# Altium project LAN test monitor.PrjPcb
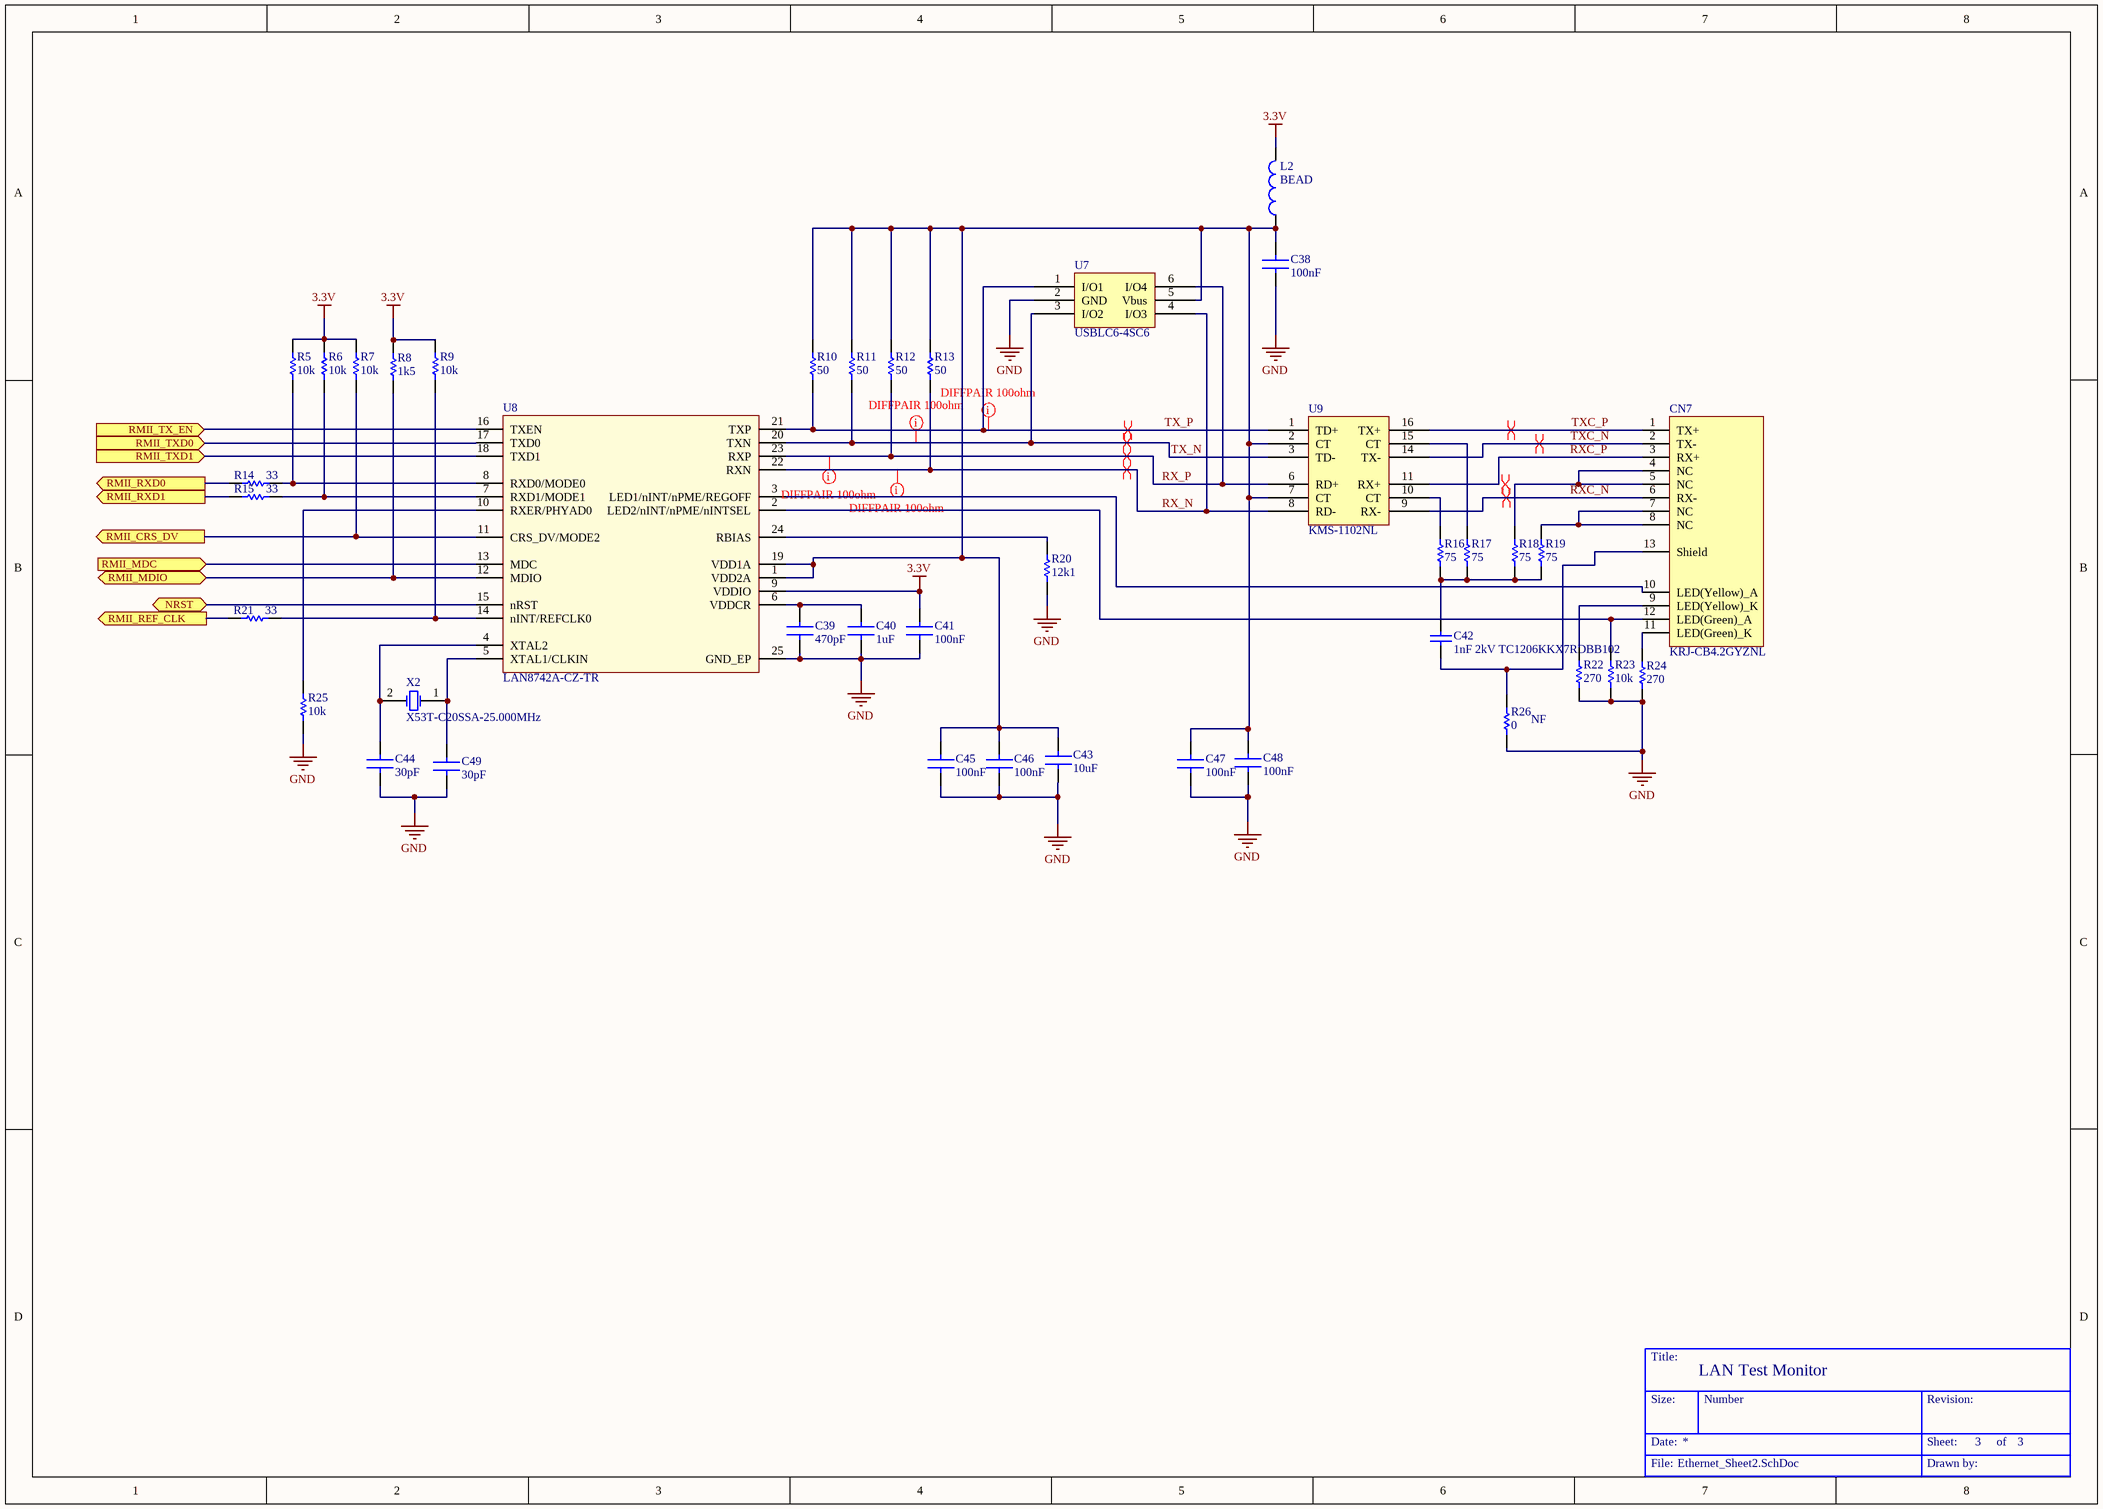
[diagram p0: Ethernet_Sheet2.SchDoc]
3 sheets, 218 parts. Net scope: flat (ports and power ports of the same name join across sheets).
Board file: Test_Monitor_PCB1.PcbDoc
Sheets:
  Ethernet_Sheet2.SchDoc
  MCU_Sheet1.SchDoc
  Input_Stage.SchDoc

## Sheet Ethernet_Sheet2.SchDoc
size A3; SheetNumber: 3; SheetTotal: 3

### Parts
(Parts that share a designator on the sheet are numbered #1, #2 ... from top to bottom, then left to right.)
*#1  Title Block  (value not drawn)  (graphical)
C38  100nF  [Cap_0603]
C39  470pF  [Cap_0603]
C40  1uF  [Cap_0603]
C41  100nF  [Cap_0603]
C42  1nF 2kV TC1206KKX7RDBB102  [CAP_1206]
C43  10uF  [Cap_0603]
C44  30pF  [Cap_0603]
C45  100nF  [Cap_0603]
C46  100nF  [Cap_0603]
C47  100nF  [Cap_0603]
C48  100nF  [Cap_0603]
C49  30pF  [Cap_0603]
CN7  KRJ-CB4.2GYZNL  [RJ45_KRJ-CB4.2GYZNL]
L2  BEAD  [Cap_0603]
R5  10k  [Res_0603]
R6  10k  [Res_0603]
R7  10k  [Res_0603]
R8  1k5  [Res_0603]
R9  10k  [Res_0603]
R10  50  [Res_0603]
R11  50  [Res_0603]
R12  50  [Res_0603]
R13  50  [Res_0603]
R14  33  [Res_0603]
R15  33  [Res_0603]
R16  75  [Res_0603]
R17  75  [Res_0603]
R18  75  [Res_0603]
R19  75  [Res_0603]
R20  12k1  [Res_0603]
R21  33  [Res_0603]
R22  270  [Res_0603]
R23  10k  [Res_0603]
R24  270  [Res_0603]
R25  10k  [Res_0603]
R26  0  [Res_0603]
U7  USBLC6-4SC6  [SOT23-6L]
U8  LAN8742A-CZ-TR  [QFN24_0R5_4X4]
U9  KMS-1102NL  [Trans. KMS-1102NL]
X2  X53T-C20SSA-25.000MHz  [XTAL_2SM_5R0X3R2]

### Ports
NRST (bidir), RMII_CRS_DV (out), RMII_MDC (in), RMII_MDIO (bidir), RMII_REF_CLK (out), RMII_RXD0 (out), RMII_RXD1 (out), RMII_TX_EN (in), RMII_TXD0 (in), RMII_TXD1 (in)

### Nets
3.3V: C41.2 L2.2 R5.2 R6.2 R7.2 R8.1 R9.2 U8.9(VDDIO)
GND: C38.1 C39.1 C40.1 C41.1 C43.1 C44.1 C45.1 C46.1 C47.1 C48.1 C49.1 R20.1 R22.1 R23.1 R24.1 R25.2 R26.1 U7.2(GND) U8.25(GND_EP)
RX_N: R13.1 U7.4(I/O3) U8.22(RXN) U9.8(RD-)
RX_P: R12.1 U7.6(I/O4) U8.23(RXP) U9.6(RD+)
RXC_N: CN7.6(RX-) U9.9(RX-)
RXC_P: CN7.3(RX+) U9.11(RX+)
TX_N: R11.1 U7.3(I/O2) U8.20(TXN) U9.3(TD-)
TX_P: R10.1 U7.1(I/O1) U8.21(TXP) U9.1(TD+)
TXC_N: CN7.2(TX-) U9.14(TX-)
TXC_P: CN7.1(TX+) U9.16(TX+)
NetC38_2: C38.2 C43.2 C45.2 C46.2 C47.2 C48.2 L2.1 R10.2 R11.2 R12.2 R13.2 U7.5(Vbus) U8.1(VDD2A) U8.19(VDD1A) U9.2(CT) U9.7(CT)
NetC39_2: C39.2 C40.2 U8.6(VDDCR)
NetC42_1: C42.1 CN7.13(Shield) R26.2
NetC42_2: C42.2 R16.1 R17.1 R18.1 R19.1
NetC44_2: C44.2 U8.4(XTAL2) X2.2(OSC2)
NetC49_2: C49.2 U8.5(XTAL1/CLKIN) X2.1(OSC1)
NetCN6_7: U8.15(nRST) ; port NRST
NetCN7_4: CN7.4(NC) CN7.5(NC) R18.2
NetCN7_7: CN7.7(NC) CN7.8(NC) R19.2
NetCN7_9: CN7.9(LED(Yellow)_K) R22.2
NetCN7_10: CN7.10(LED(Yellow)_A) U8.3(LED1/nINT/nPME/REGOFF)
NetCN7_11: CN7.11(LED(Green)_K) R24.2
NetCN7_12: CN7.12(LED(Green)_A) R23.2 U8.2(LED2/nINT/nPME/nINTSEL)
NetR5_1: R5.1 R14.2 U8.8(RXD0/MODE0)
NetR6_1: R6.1 R15.2 U8.7(RXD1/MODE1)
NetR7_1: R7.1 U8.11(CRS_DV/MODE2) ; port RMII_CRS_DV
NetR8_2: R8.2 U8.12(MDIO) ; port RMII_MDIO
NetR9_1: R9.1 R21.2 U8.14(nINT/REFCLK0)
NetR14_1: R14.1 ; port RMII_RXD0
NetR15_1: R15.1 ; port RMII_RXD1
NetR16_2: R16.2 U9.10(CT)
NetR17_2: R17.2 U9.15(CT)
NetR20_2: R20.2 U8.24(RBIAS)
NetR21_1: R21.1 ; port RMII_REF_CLK
NetR25_1: R25.1 U8.10(RXER/PHYAD0)
NetU1_27: U8.13(MDC) ; port RMII_MDC
NetU1_74: U8.18(TXD1) ; port RMII_TXD1
NetU1_126: U8.16(TXEN) ; port RMII_TX_EN
NetU1_128: U8.17(TXD0) ; port RMII_TXD0

### Layout directives
differential pair; rule Matched Net Lengths [Tolerance = 1mm]: RX_N, RX_P, RXC_N, RXC_P, TX_N, TX_P, TXC_N, TXC_P
mark named DIFFPAIR 100ohm: RX_N, RX_P, TX_N, TX_P

### Notes on the sheet
- (near R26) NF
- (in symbol Title Block) Title:; LAN Test Monitor; Size:; Number; Revision:; Date:; Sheet:; of; File:; Drawn by:

### Library data of the parts
C38 C41 C45-C48 = Cap 100nF 0603 10%
C39 = Cap 470pF 0603 10%
C40 = Cap 1uF 0603 10%
C42 = Cap 1nF 2kV: Capacitor 1nF 2kV; Value: 100nF; Revision: July-2002: Re-released for DXP Platform.
C43 = Cap 10uF 0603 10%
C44 C49 = Cap 30 pF 0603
CN7 = KRJ-CB4.2GYZNL: 100 Base-TX (Fast Ethernet) SMD RJ45 single port (1x1) with LEDS Integrated Magnetics Connector; Manuf_1: HanRun; Manuf_Part_1: HR961160C; Manuf_2: Pulse Electronics Corporation; Manuf_Part_2: J3011G21DNLT; Manuf_3: K.O.D International Holding; Manuf_Part_3: RMT-119A-12F6-GY-04; Distrib: Sub Co; Order: *
L2 = Inductor: Value: 100uH; Published: 8-Jun-2000; Revision: July-2002: Re-released for DXP Platform.; Publisher: Altium Limited
R5-R7 R9 R23 R25 = Res 10k 1% 0603: Manuf_Part_1: MCT 0603-50 1% P5 12K1; Manuf_1: VISHAY; Value: 12K1; Order: 2325243; ECCN_US/EU: n/a; Distrib: FARNELL
R8 = Res 1k5 1% 0603: Manuf_Part_1: MCT 0603-50 1% P5 12K1; Manuf_1: VISHAY; Value: 12K1; Order: 2325243; ECCN_US/EU: n/a; Distrib: FARNELL
R10-R13 = Res 50 1% 0603: Manuf_Part_1: MCT 0603-50 1% P5 12K1; Manuf_1: VISHAY; Value: 12K1; Order: 2325243; ECCN_US/EU: n/a; Distrib: FARNELL
R14 R15 R21 = Res 33 1% 0603: Manuf_Part_1: MCT 0603-50 1% P5 12K1; Manuf_1: VISHAY; Value: 12K1; Order: 2325243; ECCN_US/EU: n/a; Distrib: FARNELL
R16-R19 = Res 75 1% 0603: Manuf_Part_1: MCT 0603-50 1% P5 12K1; Manuf_1: VISHAY; Value: 12K1; Order: 2325243; ECCN_US/EU: n/a; Distrib: FARNELL
R20 = Res 12k1 1% 0603: Manuf_Part_1: MCT 0603-50 1% P5 12K1; Manuf_1: VISHAY; Order: 2325243; Value: 12K1; ECCN_US/EU: n/a; Distrib: FARNELL
R22 R24 = Res 270 1% 0603: Manuf_Part_1: MCT 0603-50 1% P5 12K1; Manuf_1: VISHAY; Value: 12K1; Order: 2325243; ECCN_US/EU: n/a; Distrib: FARNELL
R26 = Res 0 1% 0603: Manuf_Part_1: MCT 0603-50 1% P5 12K1; Manuf_1: VISHAY; Value: 12K1; Order: 2325243; ECCN_US/EU: n/a; Distrib: FARNELL
U8 = LAN8742A-CZ-TR: LAN8742A-CZ-TR - Small Footprint RMII 10/100 Ethernet, Transceiver with HP Auto-MDIX and flexPWR Technology SQFN-24; Manuf_1: MICROCHIP; Order: LAN8742A-CZ-TR; Manuf_Part_1: LAN8742A-CZ-TR; Distrib: MICROCHIP
U9 = KMS-1102NL_1
X2 = X53T-C20SSA-25.000MHz: Crystal Oscillator 25M; Published: 8-Jun-2000; LatestRevisionDate: 17-Jul-2002; LatestRevisionNote: Re-released for DXP Platform.; PackageReference: R38; Publisher: Altium Limited

## Sheet MCU_Sheet1.SchDoc
size A3; SheetNumber: 1; SheetTotal: 3
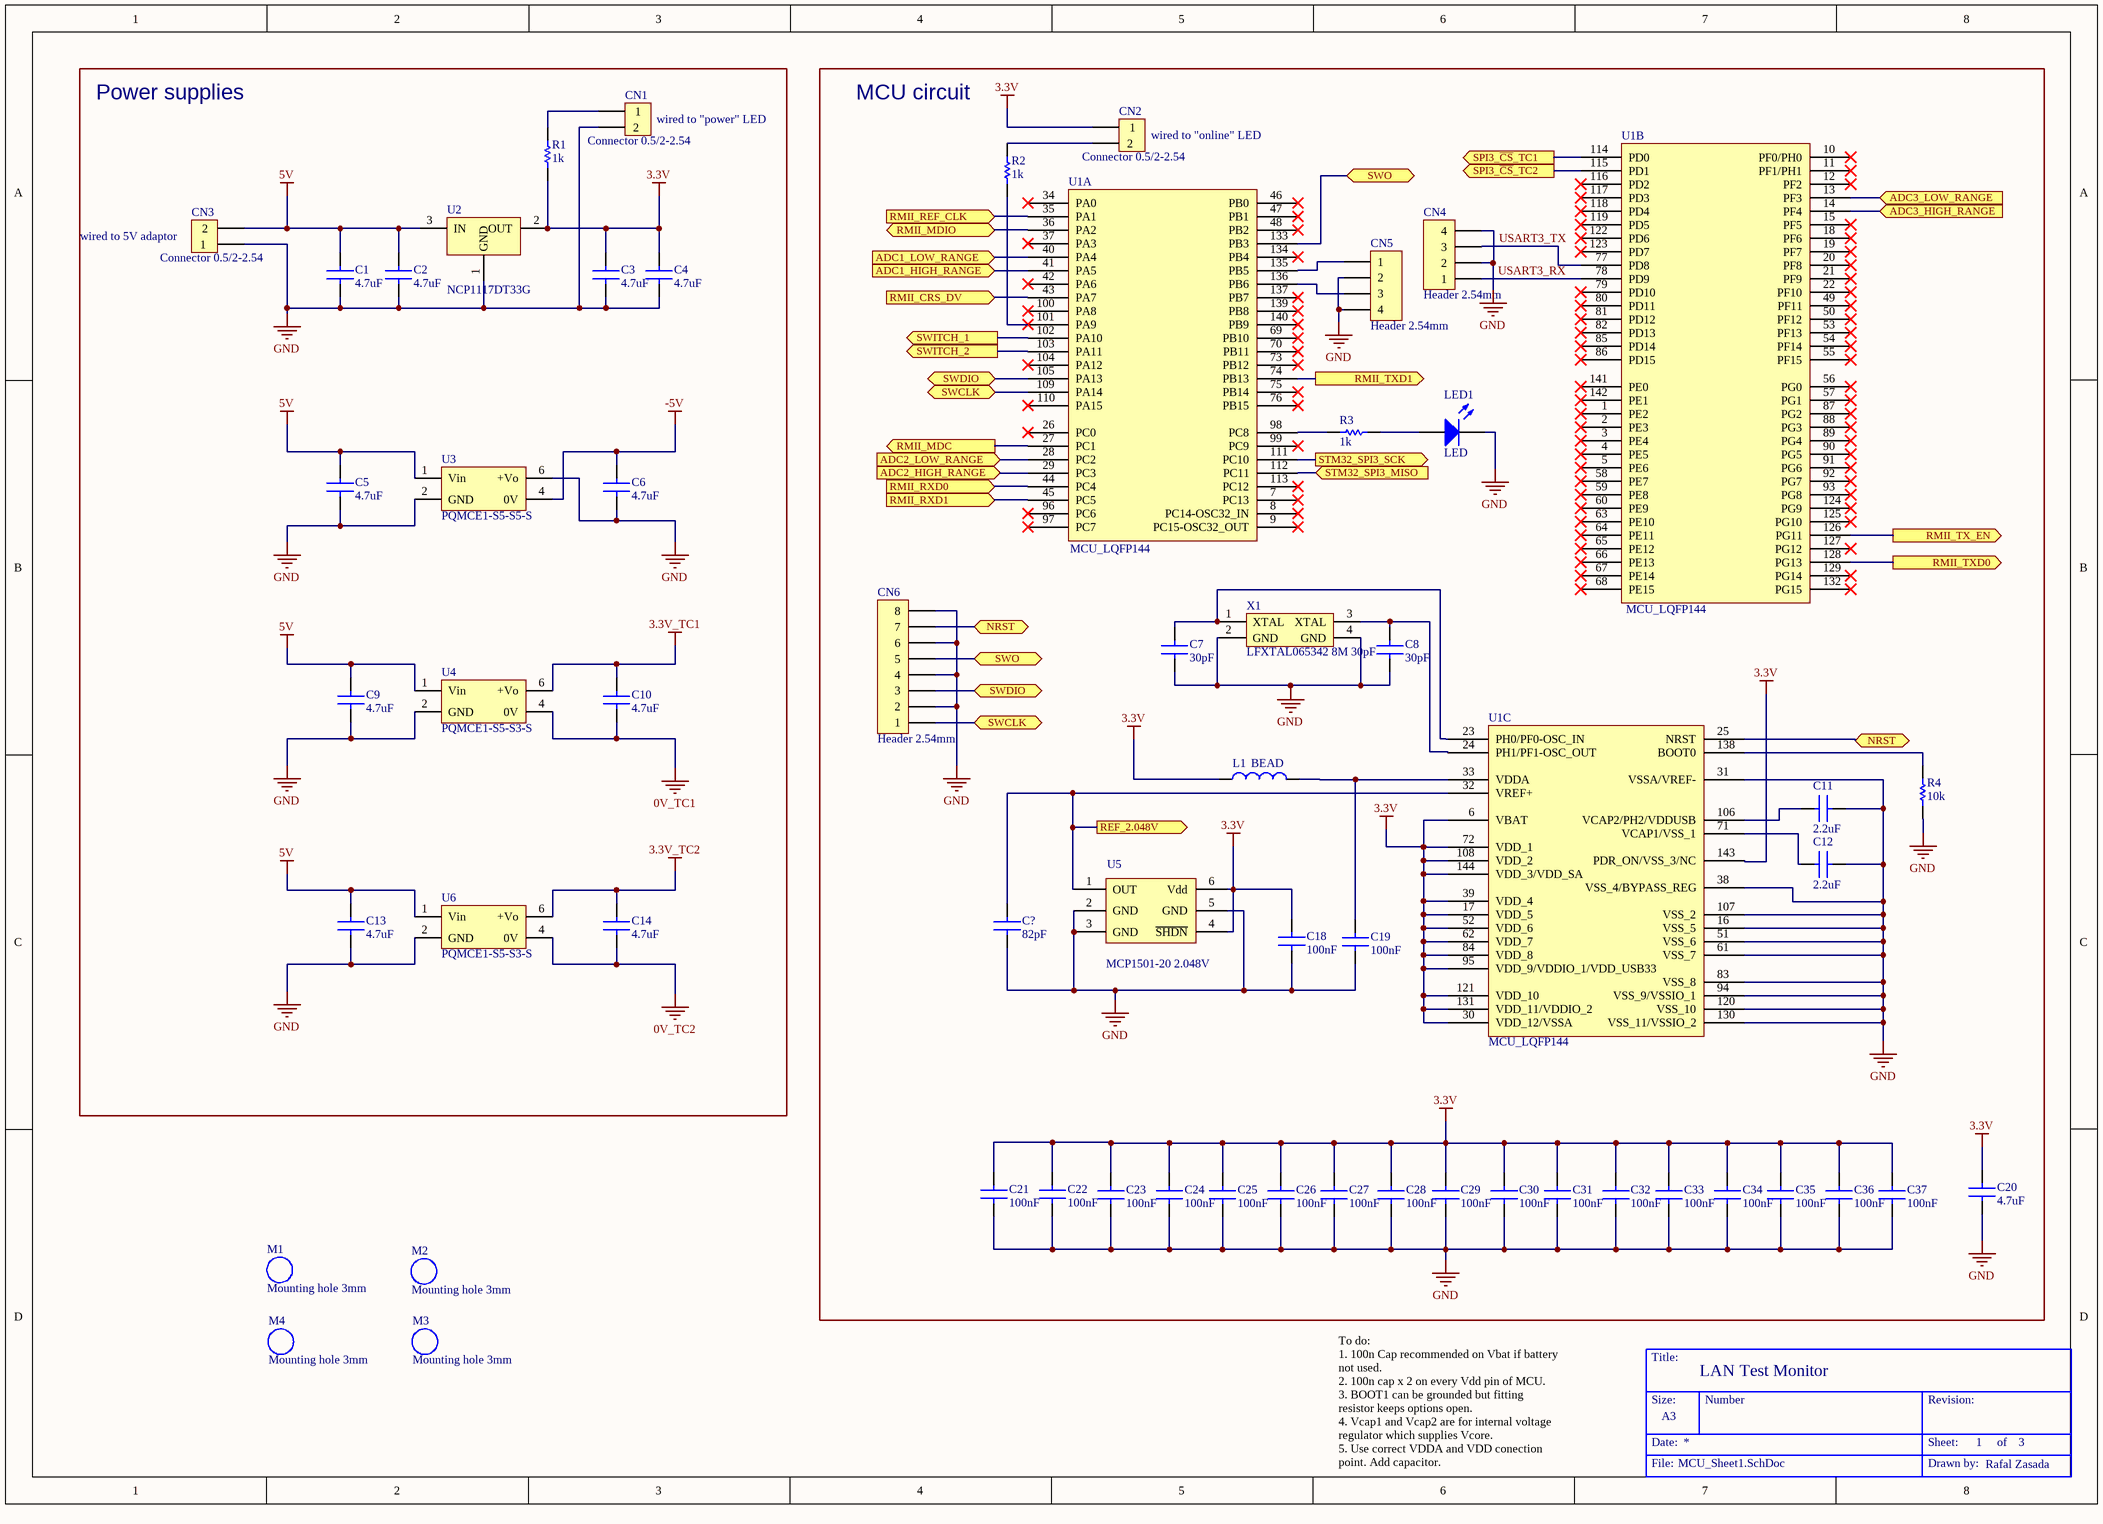
[diagram p1: MCU_Sheet1.SchDoc]

### Parts
(Parts that share a designator on the sheet are numbered #1, #2 ... from top to bottom, then left to right.)
*#2  Title Block  (value not drawn)  (graphical)
C1  4.7uF  [Cap_0603]
C2  4.7uF  [Cap_0603]
C3  4.7uF  [Cap_0603]
C4  4.7uF  [Cap_0603]
C5  4.7uF  [Cap_0603]
C6  4.7uF  [Cap_0603]
C7  30pF  [Cap_0603]
C8  30pF  [Cap_0603]
C9  4.7uF  [Cap_0603]
C10  4.7uF  [Cap_0603]
C11  2.2uF  [Cap_0603]
C12  2.2uF  [Cap_0603]
C13  4.7uF  [Cap_0603]
C14  4.7uF  [Cap_0603]
C15  82pF  [Cap_0603]
C18  100nF  [Cap_0603]
C19  100nF  [Cap_0603]
C20  4.7uF  [Cap_0603]
C21  100nF  [Cap_0603]
C22  100nF  [Cap_0603]
C23  100nF  [Cap_0603]
C24  100nF  [Cap_0603]
C25  100nF  [Cap_0603]
C26  100nF  [Cap_0603]
C27  100nF  [Cap_0603]
C28  100nF  [Cap_0603]
C29  100nF  [Cap_0603]
C30  100nF  [Cap_0603]
C31  100nF  [Cap_0603]
C32  100nF  [Cap_0603]
C33  100nF  [Cap_0603]
C34  100nF  [Cap_0603]
C35  100nF  [Cap_0603]
C36  100nF  [Cap_0603]
C37  100nF  [Cap_0603]
CN1  Connector 0.5/2-2.54  [Connector 0.5/2-2.54]
CN2  Connector 0.5/2-2.54  [Connector 0.5/2-2.54]
CN3  Connector 0.5/2-2.54  [Connector 0.5/2-2.54]
CN4  Header 2.54mm  [header 2.54mm 4way]
CN5  Header 2.54mm  [header 2.54mm 4way]
CN6  Header 2.54mm  [header 2.54mm 8way]
L1  BEAD  [Cap_0603]
LED1  LED  [LED 0603]
M1  Mounting hole 3mm  [Mounting_Hole_3mm]
M2  Mounting hole 3mm  [Mounting_Hole_3mm]
M3  Mounting hole 3mm  [Mounting_Hole_3mm]
M4  Mounting hole 3mm  [Mounting_Hole_3mm]
R1  1k  [Res_0603]
R2  1k  [Res_0603]
R3  1k  [Res_0603]
R4  10k  [Res_0603]
U1  MCU_LQFP144  [LQFP144_0R5_SKT]  (parts A,B,C of 3)
U2  NCP1117DT33G  [DPACK]
U3  PQMCE1-S5-S5-S  [PQMCE1 (DC-DC conv.)]
U4  PQMCE1-S5-S3-S  [PQMCE1 (DC-DC conv.)]
U5  MCP1501-20 2.048V  [SOT23 MCP1501]
U6  PQMCE1-S5-S3-S  [PQMCE1 (DC-DC conv.)]
X1  LFXTAL065342 8M 30pF  [LFXTAL065342Reel]

### Blocks framed on the sheet
Power supplies: C1-C6 C9 C10 C13 C14 CN1 CN3 R1 U2-U4 U6
MCU circuit: C7 C8 C11 C12 C15 C18-C37 CN2 CN4-CN6 L1 LED1 R2-R4 U1 U5 X1

### Ports
ADC1_HIGH_RANGE (in), ADC1_LOW_RANGE (in), ADC2_HIGH_RANGE (in), ADC2_LOW_RANGE (in), ADC3_HIGH_RANGE (in), ADC3_LOW_RANGE (in), NRST (bidir), REF_2.048V (out), RMII_CRS_DV (in), RMII_MDC (out), RMII_MDIO (bidir), RMII_REF_CLK (in), RMII_RXD0 (in), RMII_RXD1 (in), RMII_TX_EN (out), RMII_TXD0 (out), RMII_TXD1 (out), SPI3_~{CS}_TC1 (out), SPI3_~{CS}_TC2 (out), STM32_SPI3_MISO (in), STM32_SPI3_SCK (out), SWCLK (bidir), SWDIO (bidir), SWITCH_1 (out), SWITCH_2 (out), SWO (bidir)

### Nets
0V_TC1: C10.1 U4.4(0V)
0V_TC2: C14.1 U6.4(0V)
3.3V: C3.2 C4.2 C18.2 C20.2 C21.2 C22.2 C23.2 C24.2 C25.2 C26.2 C27.2 C28.2 C29.2 C30.2 C31.2 C32.2 C33.2 C34.2 C35.2 C36.2 C37.2 CN2.1 L1.1 R1.1 U1.6(VBAT) U1.17(VDD_5) U1.30(VDD_12/VSSA) U1.39(VDD_4) U1.52(VDD_6) U1.62(VDD_7) U1.72(VDD_1) U1.84(VDD_8) U1.95(VDD_9/VDDIO_1/VDD_USB33) U1.108(VDD_2) U1.121(VDD_10) U1.131(VDD_11/VDDIO_2) U1.143(PDR_ON/VSS_3/NC) U1.144(VDD_3/VDD_SA) U2.2(OUT) U5.4(~{SHDN}) U5.6(Vdd)
3.3V_TC1: C10.2 U4.6(+Vo)
3.3V_TC2: C14.2 U6.6(+Vo)
5V: C1.2 C2.2 C5.2 C9.2 C13.2 CN3.2 U2.3(IN) U3.1(Vin) U4.1(Vin) U6.1(Vin)
-5V: C6.2 U3.4(0V)
GND: C1.1 C2.1 C3.1 C4.1 C5.1 C6.1 C7.1 C8.1 C9.1 C11.2 C12.2 C13.1 C15.1 C18.1 C19.1 C20.1 C21.1 C22.1 C23.1 C24.1 C25.1 C26.1 C27.1 C28.1 C29.1 C30.1 C31.1 C32.1 C33.1 C34.1 C35.1 C36.1 C37.1 CN1.2 CN3.1 CN4.2 CN4.4 CN5.2 CN5.4 CN6.2 CN6.4 CN6.6 CN6.8 LED1.2(K) R4.1 U1.16(VSS_5) U1.31(VSSA/VREF-) U1.38(VSS_4/BYPASS_REG) U1.51(VSS_6) U1.61(VSS_7) U1.83(VSS_8) U1.94(VSS_9/VSSIO_1) U1.107(VSS_2) U1.120(VSS_10) U1.130(VSS_11/VSSIO_2) U2.1(GND) U3.2(GND) U3.6(+Vo) U4.2(GND) U5.2(GND) U5.3(GND) U5.5(GND) U6.2(GND) X1.2(GND) X1.4(GND)
REF_2.048V: C15.2 U1.32(VREF+) U5.1(OUT) ; port REF_2.048V
USART3_RX: CN4.1 U1.78(PD9)
USART3_TX: CN4.3 U1.77(PD8)
NetC7_2: C7.2 U1.23(PH0/PF0-OSC_IN) X1.1(XTAL)
NetC8_2: C8.2 U1.24(PH1/PF1-OSC_OUT) X1.3(XTAL)
NetC11_1: C11.1 U1.106(VCAP2/PH2/VDDUSB)
NetC12_1: C12.1 U1.71(VCAP1/VSS_1)
NetC19_2: C19.2 L1.2 U1.33(VDDA)
NetCN1_1: CN1.1 R1.2
NetCN2_2: CN2.2 R2.2
NetCN5_1: CN5.1 U1.135(PB5)
NetCN5_3: CN5.3 U1.136(PB6)
NetCN6_1: CN6.1 U1.109(PA14) ; port SWCLK
NetCN6_3: CN6.3 U1.105(PA13) ; port SWDIO
NetCN6_5: CN6.5 U1.133(PB3) ; port SWO
NetCN6_7: CN6.7 U1.25(NRST) ; port NRST
NetD5_2: U1.41(PA5) ; port ADC1_HIGH_RANGE
NetD6_2: U1.40(PA4) ; port ADC1_LOW_RANGE
NetD11_2: U1.29(PC3) ; port ADC2_HIGH_RANGE
NetD12_2: U1.28(PC2) ; port ADC2_LOW_RANGE
NetD17_2: U1.14(PF4) ; port ADC3_HIGH_RANGE
NetD18_2: U1.13(PF3) ; port ADC3_LOW_RANGE
NetLED1_1: LED1.1(A) R3.2
NetR2_1: R2.1 U1.101(PA9)
NetR3_1: R3.1 U1.98(PC8)
NetR4_2: R4.2 U1.138(BOOT0)
NetR7_1: U1.43(PA7) ; port RMII_CRS_DV
NetR8_2: U1.36(PA2) ; port RMII_MDIO
NetR14_1: U1.44(PC4) ; port RMII_RXD0
NetR15_1: U1.45(PC5) ; port RMII_RXD1
NetR21_1: U1.35(PA1) ; port RMII_REF_CLK
NetR66_1: U1.102(PA10) ; port SWITCH_1
NetR67_1: U1.103(PA11) ; port SWITCH_2
NetU1_27: U1.27(PC1) ; port RMII_MDC
NetU1_74: U1.74(PB13) ; port RMII_TXD1
NetU1_111: U1.111(PC10) ; port STM32_SPI3_SCK
NetU1_112: U1.112(PC11) ; port STM32_SPI3_MISO
NetU1_114: U1.114(PD0) ; port SPI3_~{CS}_TC1
NetU1_115: U1.115(PD1) ; port SPI3_~{CS}_TC2
NetU1_126: U1.126(PG11) ; port RMII_TX_EN
NetU1_128: U1.128(PG13) ; port RMII_TXD0

Not connected (* = marked no-connect by the designer): U1 1(PE2)* 2(PE3)* 3(PE4)* 4(PE5)* 5(PE6)* 7(PC13)* 8(PC14-OSC32_IN)* 9(PC15-OSC32_OUT)* 10(PF0/PH0)* 11(PF1/PH1)* 12(PF2)* 15(PF5)* 18(PF6)* 19(PF7)* 20(PF8)* 21(PF9)* 22(PF10)* 26(PC0)* 34(PA0)* 37(PA3)* 42(PA6)* 46(PB0)* 47(PB1)* 48(PB2)* 49(PF11)* 50(PF12)* 53(PF13)* 54(PF14)* 55(PF15)* 56(PG0)* 57(PG1)* 58(PE7)* 59(PE8)* 60(PE9)* 63(PE10)* 64(PE11)* 65(PE12)* 66(PE13)* 67(PE14)* 68(PE15)* 69(PB10)* 70(PB11)* 73(PB12)* 75(PB14)* 76(PB15)* 79(PD10)* 80(PD11)* 81(PD12)* 82(PD13)* 85(PD14)* 86(PD15)* 87(PG2)* 88(PG3)* 89(PG4)* 90(PG5)* 91(PG6)* 92(PG7)* 93(PG8)* 96(PC6)* 97(PC7)* 99(PC9)* 100(PA8)* 104(PA12)* 110(PA15)* 113(PC12)* 116(PD2)* 117(PD3)* 118(PD4)* 119(PD5)* 122(PD6)* 123(PD7)* 124(PG9)* 125(PG10)* 127(PG12)* 129(PG14)* 132(PG15)* 134(PB4)* 137(PB7)* 139(PB8)* 140(PB9)* 141(PE0)* 142(PE1)*

### Notes on the sheet
- (near CN1) wired to "power" LED
- (near CN2) wired to "online" LED
- (near CN3) wired to 5V adaptor
- To do:
  1. 100n Cap recommended on Vbat if battery not used.
  2. 100n cap x 2 on every Vdd pin of MCU.
  3. BOOT1 can be grounded but fitting resistor keeps options open.
  4. Vcap1 and Vcap2 are for internal voltage regulator which supplies Vcore.
  5. Use correct VDDA and VDD conection point. Add capacitor.
- A3
- Rafal Zasada
- (in symbol Title Block) Title:; LAN Test Monitor; Size:; Number; Revision:; Date:; Sheet:; of; File:; Drawn by:

### Library data of the parts
C1-C6 C9 C10 C13 C14 C20 = Cap 4.7uF 0603 10%
C7 C8 = Cap 30 pF 0603
C11 C12 = Cap 2.2uF 0603 10%
C15 = Cap 82pF 0603 10%
C18 C19 C21-C37 = Cap 100nF 0603 10%
CN1-CN3 = Phoenix Contact MPT 0.5/2-2.54
CN4 CN5 = Header plug 2.54mm 4 way
CN6 = Header plug 2.54mm 8 way
L1 = Inductor: Value: 100uH; Published: 8-Jun-2000; Revision: July-2002: Re-released for DXP Platform.; Publisher: Altium Limited
LED1 = LED 0603
R1-R3 = Res 1k 1% 0603: Manuf_Part_1: MCT 0603-50 1% P5 12K1; Manuf_1: VISHAY; Value: 12K1; Order: 2325243; ECCN_US/EU: n/a; Distrib: FARNELL
R4 = Res 10k 1% 0603: as R5 on sheet Ethernet_Sheet2; ECCN_US/EU: n/a; Distrib: FARNELL
U2 = NCP1117DT33G: Voltage regulator output 3.3V 800mA (JLC PCB) DPACK
U3 = PQMCE1-S5-S5-S: DC-DC isolated coverter 5V to 5V
U4 U6 = PQMCE1-S5-S3-S: DC-DC isolated coverter 5V to 3.3V
U5 = MCP1501: Voltage reference MCP1501T-20E/CHY
X1 = LFXTAL065342

## Sheet Input_Stage.SchDoc
size A3; SheetNumber: 2; SheetTotal: 3
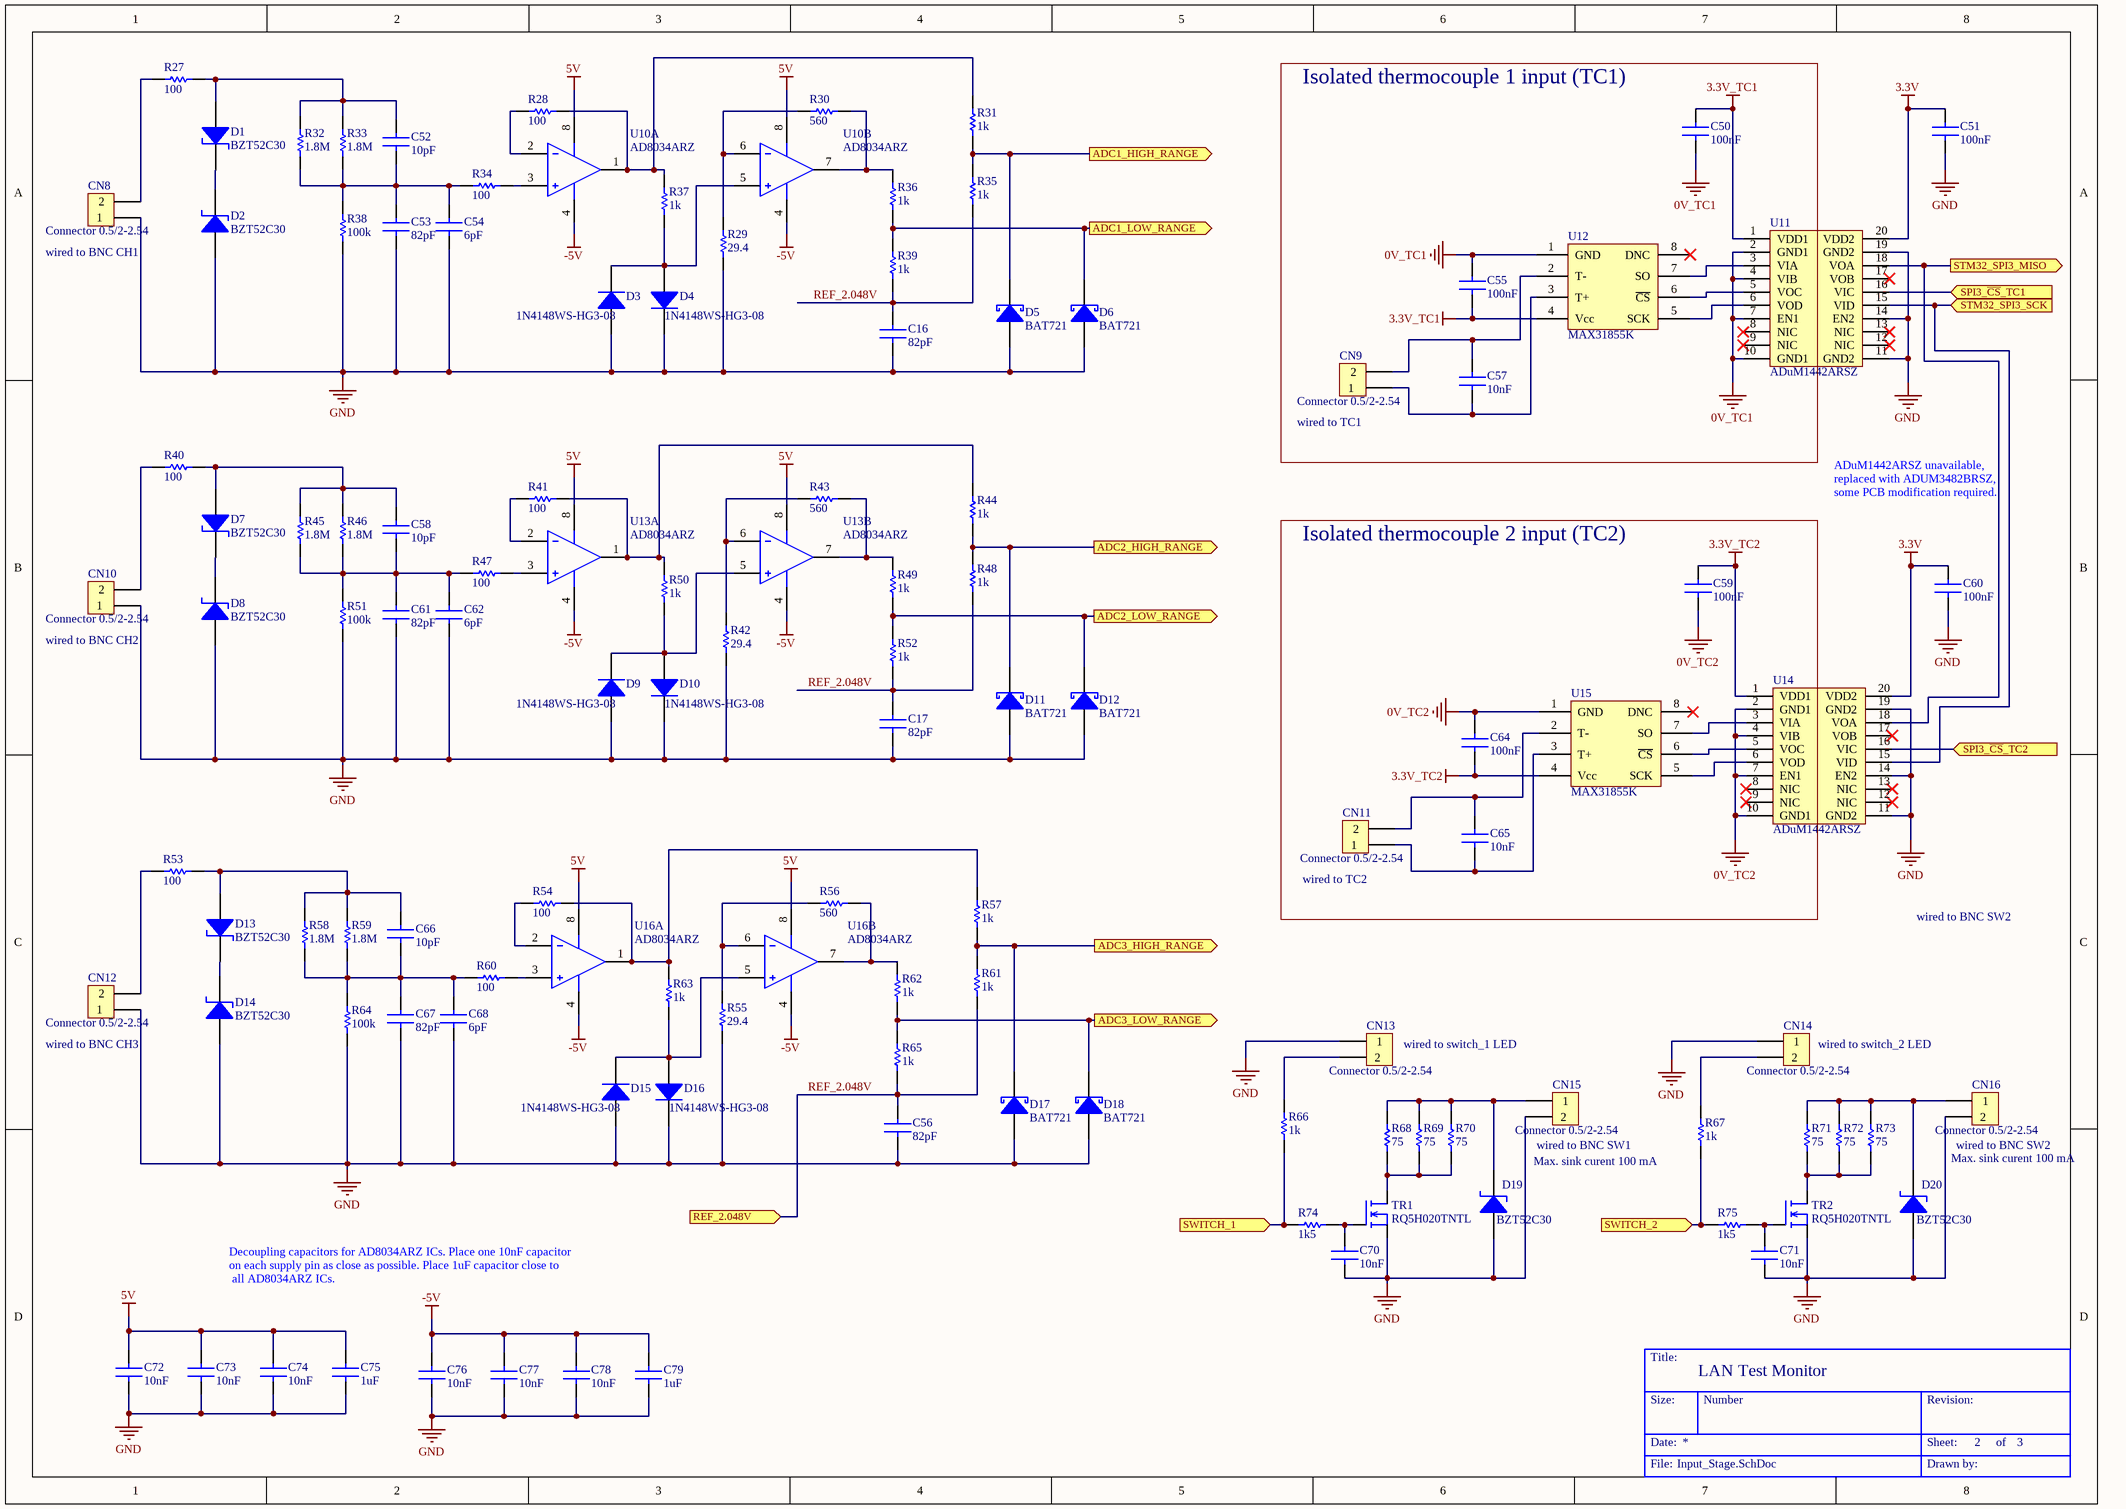
[diagram p2: Input_Stage.SchDoc]

### Parts
(Parts that share a designator on the sheet are numbered #1, #2 ... from top to bottom, then left to right.)
*#3  Title Block  (value not drawn)  (graphical)
C16  82pF  [Cap_0603]
C17  82pF  [Cap_0603]
C50  100nF  [Cap_0603]
C51  100nF  [Cap_0603]
C52  10pF  [Cap_0603]
C53  82pF  [Cap_0603]
C54  6pF  [Cap_0603]
C55  100nF  [Cap_0603]
C56  82pF  [Cap_0603]
C57  10nF  [Cap_0603]
C58  10pF  [Cap_0603]
C59  100nF  [Cap_0603]
C60  100nF  [Cap_0603]
C61  82pF  [Cap_0603]
C62  6pF  [Cap_0603]
C64  100nF  [Cap_0603]
C65  10nF  [Cap_0603]
C66  10pF  [Cap_0603]
C67  82pF  [Cap_0603]
C68  6pF  [Cap_0603]
C70  10nF  [Cap_0603]
C71  10nF  [Cap_0603]
C72  10nF  [Cap_0603]
C73  10nF  [Cap_0603]
C74  10nF  [Cap_0603]
C75  1uF  [Cap_0603]
C76  10nF  [Cap_0603]
C77  10nF  [Cap_0603]
C78  10nF  [Cap_0603]
C79  1uF  [Cap_0603]
CN8  Connector 0.5/2-2.54  [Connector 0.5/2-2.54]
CN9  Connector 0.5/2-2.54  [Connector 0.5/2-2.54]
CN10  Connector 0.5/2-2.54  [Connector 0.5/2-2.54]
CN11  Connector 0.5/2-2.54  [Connector 0.5/2-2.54]
CN12  Connector 0.5/2-2.54  [Connector 0.5/2-2.54]
CN13  Connector 0.5/2-2.54  [Connector 0.5/2-2.54]
CN14  Connector 0.5/2-2.54  [Connector 0.5/2-2.54]
CN15  Connector 0.5/2-2.54  [Connector 0.5/2-2.54]
CN16  Connector 0.5/2-2.54  [Connector 0.5/2-2.54]
D1  BZT52C30  [SOD123 BZT52C30]
D2  BZT52C30  [SOD123 BZT52C30]
D3  1N4148WS-HG3-08  [SOD-323 diode 1N4148WS-HG3-08]
D4  1N4148WS-HG3-08  [SOD-323 diode 1N4148WS-HG3-08]
D5  BAT721  [SOT23 BAT721]
D6  BAT721  [SOT23 BAT721]
D7  BZT52C30  [SOD123 BZT52C30]
D8  BZT52C30  [SOD123 BZT52C30]
D9  1N4148WS-HG3-08  [SOD-323 diode 1N4148WS-HG3-08]
D10  1N4148WS-HG3-08  [SOD-323 diode 1N4148WS-HG3-08]
D11  BAT721  [SOT23 BAT721]
D12  BAT721  [SOT23 BAT721]
D13  BZT52C30  [SOD123 BZT52C30]
D14  BZT52C30  [SOD123 BZT52C30]
D15  1N4148WS-HG3-08  [SOD-323 diode 1N4148WS-HG3-08]
D16  1N4148WS-HG3-08  [SOD-323 diode 1N4148WS-HG3-08]
D17  BAT721  [SOT23 BAT721]
D18  BAT721  [SOT23 BAT721]
D19  BZT52C30  [SOD123 BZT52C30]
D20  BZT52C30  [SOD123 BZT52C30]
R27  100  [Res_0603]
R28  100  [Res_0603]
R29  29.4  [Res_0603]
R30  560  [Res_0603]
R31  1k  [Res_0603]
R32  1.8M  [Res_0603]
R33  1.8M  [Res_0603]
R34  100  [Res_0603]
R35  1k  [Res_0603]
R36  1k  [Res_0603]
R37  1k  [Res_0603]
R38  100k  [Res_0603]
R39  1k  [Res_0603]
R40  100  [Res_0603]
R41  100  [Res_0603]
R42  29.4  [Res_0603]
R43  560  [Res_0603]
R44  1k  [Res_0603]
R45  1.8M  [Res_0603]
R46  1.8M  [Res_0603]
R47  100  [Res_0603]
R48  1k  [Res_0603]
R49  1k  [Res_0603]
R50  1k  [Res_0603]
R51  100k  [Res_0603]
R52  1k  [Res_0603]
R53  100  [Res_0603]
R54  100  [Res_0603]
R55  29.4  [Res_0603]
R56  560  [Res_0603]
R57  1k  [Res_0603]
R58  1.8M  [Res_0603]
R59  1.8M  [Res_0603]
R60  100  [Res_0603]
R61  1k  [Res_0603]
R62  1k  [Res_0603]
R63  1k  [Res_0603]
R64  100k  [Res_0603]
R65  1k  [Res_0603]
R66  1k  [Res_0603]
R67  1k  [Res_0603]
R68  75  [Res_0603]
R69  75  [Res_0603]
R70  75  [Res_0603]
R71  75  [Res_0603]
R72  75  [Res_0603]
R73  75  [Res_0603]
R74  1k5  [Res_0603]
R75  1k5  [Res_0603]
TR1  RQ5H020TNTL  [SOT-346-3 RQ5H020TN]
TR2  RQ5H020TNTL  [SOT-346-3 RQ5H020TN]
U10  AD8034ARZ  [8-SOIC_N AD8034ARZ]  (parts A,B of 2)
U11  ADuM1442ARSZ  [SSOP ADuM1442ARSZ]
U12  MAX31855K  [SOIC127P600X175-8N]
U13  AD8034ARZ  [8-SOIC_N AD8034ARZ]  (parts A,B of 2)
U14  ADuM1442ARSZ  [SSOP ADuM1442ARSZ]
U15  MAX31855K  [SOIC127P600X175-8N]
U16  AD8034ARZ  [8-SOIC_N AD8034ARZ]  (parts A,B of 2)

### Blocks framed on the sheet
Isolated thermocouple 1 input (TC1): C50 C55 C57 CN9 U11 U12
Isolated thermocouple 2 input (TC2): C59 C64 C65 CN11 U15

### Ports
ADC1_HIGH_RANGE (out), ADC1_LOW_RANGE (out), ADC2_HIGH_RANGE (out), ADC2_LOW_RANGE (out), ADC3_HIGH_RANGE (out), ADC3_LOW_RANGE (out), REF_2.048V (in), SPI3_~{CS}_TC1 (in), SPI3_~{CS}_TC2 (in), STM32_SPI3_MISO (out), STM32_SPI3_SCK (in), SWITCH_1 (in), SWITCH_2 (in)

### Nets
0V_TC1: C50.1 C55.2 U11.2(GND1) U11.4(VIB) U11.7(EN1) U11.10(GND1) U12.1(GND)
0V_TC2: C59.1 C64.2 U14.2(GND1) U14.4(VIB) U14.7(EN1) U14.10(GND1) U15.1(GND)
3.3V: C51.2 C60.2 U11.20(VDD2) U14.20(VDD2)
3.3V_TC1: C50.2 C55.1 U11.1(VDD1) U12.4(Vcc)
3.3V_TC2: C59.2 C64.1 U14.1(VDD1) U15.4(Vcc)
5V: C72.2 C73.2 C74.2 C75.2 U10.8(V+) U13.8(V+) U16.8(V+)
-5V: C76.2 C77.2 C78.2 C79.2 U10.4(V-) U13.4(V-) U16.4(V-)
GND: C16.1 C17.1 C51.1 C53.1 C54.1 C56.1 C60.1 C61.1 C62.1 C67.1 C68.1 C70.2 C71.2 C72.1 C73.1 C74.1 C75.1 C76.1 C77.1 C78.1 C79.1 CN8.1 CN10.1 CN12.1 CN13.1 CN14.1 CN15.2 CN16.2 D2.1(A) D3.1(A) D4.2(K) D5.1(A) D6.1(A) D8.1(A) D9.1(A) D10.2(K) D11.1(A) D12.1(A) D14.1(A) D15.1(A) D16.2(K) D17.1(A) D18.1(A) D19.1(A) D20.1(A) R29.1 R38.1 R42.1 R51.1 R55.1 R64.1 TR1.3 TR2.3 U11.11(GND2) U11.14(EN2) U11.19(GND2) U14.11(GND2) U14.14(EN2) U14.19(GND2)
REF_2.048V: C16.2 C17.2 C56.2 R35.2 R39.2 R48.2 R52.2 R61.2 R65.2 ; port REF_2.048V
NetC52_1: C52.1 C53.2 C54.2 R32.1 R33.1 R34.1 R38.2
NetC52_2: C52.2 D1.1(A) R27.2 R32.2 R33.2
NetC57_1: C57.1 CN9.1 U12.3(T+)
NetC57_2: C57.2 CN9.2 U12.2(T-)
NetC58_1: C58.1 C61.2 C62.2 R45.1 R46.1 R47.1 R51.2
NetC58_2: C58.2 D7.1(A) R40.2 R45.2 R46.2
NetC65_1: C65.1 CN11.1 U15.3(T+)
NetC65_2: C65.2 CN11.2 U15.2(T-)
NetC66_1: C66.1 C67.2 C68.2 R58.1 R59.1 R60.1 R64.2
NetC66_2: C66.2 D13.1(A) R53.2 R58.2 R59.2
NetC70_1: C70.1 R74.2 TR1.1
NetC71_1: C71.1 R75.2 TR2.1
NetCN8_2: CN8.2 R27.1
NetCN10_2: CN10.2 R40.1
NetCN12_2: CN12.2 R53.1
NetCN13_2: CN13.2 R66.2
NetCN14_2: CN14.2 R67.2
NetCN15_1: CN15.1 D19.2(K) R68.2 R69.2 R70.2
NetCN16_1: CN16.1 D20.2(K) R71.2 R72.2 R73.2
NetD1_2: D1.2(K) D2.2(K)
NetD3_2: D3.2(K) D4.1(A) R37.1 U10.5(+IN2)
NetD5_2: D5.2(K) R31.2 R35.1 ; port ADC1_HIGH_RANGE
NetD6_2: D6.2(K) R36.2 R39.1 ; port ADC1_LOW_RANGE
NetD7_2: D7.2(K) D8.2(K)
NetD9_2: D9.2(K) D10.1(A) R50.1 U13.5(+IN2)
NetD11_2: D11.2(K) R44.2 R48.1 ; port ADC2_HIGH_RANGE
NetD12_2: D12.2(K) R49.2 R52.1 ; port ADC2_LOW_RANGE
NetD13_2: D13.2(K) D14.2(K)
NetD15_2: D15.2(K) D16.1(A) R63.1 U16.5(+IN2)
NetD17_2: D17.2(K) R57.2 R61.1 ; port ADC3_HIGH_RANGE
NetD18_2: D18.2(K) R62.2 R65.1 ; port ADC3_LOW_RANGE
NetR28_1: R28.1 U10.2(-IN1)
NetR28_2: R28.2 R31.1 R37.2 U10.1(OUT1)
NetR29_2: R29.2 R30.1 U10.6(-IN2)
NetR30_2: R30.2 R36.1 U10.7(OUT1)
NetR34_2: R34.2 U10.3(+IN1)
NetR41_1: R41.1 U13.2(-IN1)
NetR41_2: R41.2 R44.1 R50.2 U13.1(OUT1)
NetR42_2: R42.2 R43.1 U13.6(-IN2)
NetR43_2: R43.2 R49.1 U13.7(OUT1)
NetR47_2: R47.2 U13.3(+IN1)
NetR54_1: R54.1 U16.2(-IN1)
NetR54_2: R54.2 R57.1 R63.2 U16.1(OUT1)
NetR55_2: R55.2 R56.1 U16.6(-IN2)
NetR56_2: R56.2 R62.1 U16.7(OUT1)
NetR60_2: R60.2 U16.3(+IN1)
NetR66_1: R66.1 R74.1 ; port SWITCH_1
NetR67_1: R67.1 R75.1 ; port SWITCH_2
NetR68_1: R68.1 R69.1 R70.1 TR1.2
NetR71_1: R71.1 R72.1 R73.1 TR2.2
NetU1_111: U11.15(VID) U14.15(VID) ; port STM32_SPI3_SCK
NetU1_112: U11.18(VOA) U14.18(VOA) ; port STM32_SPI3_MISO
NetU1_114: U11.16(VIC) ; port SPI3_~{CS}_TC1
NetU1_115: U14.16(VIC) ; port SPI3_~{CS}_TC2
NetU11_3: U11.3(VIA) U12.7(SO)
NetU11_5: U11.5(VOC) U12.6(~{CS})
NetU11_6: U11.6(VOD) U12.5(SCK)
NetU14_3: U14.3(VIA) U15.7(SO)
NetU14_5: U14.5(VOC) U15.6(~{CS})
NetU14_6: U14.6(VOD) U15.5(SCK)

Not connected (* = marked no-connect by the designer): U11 8(NIC)* 9(NIC)* 12(NIC)* 13(NIC)* 17(VOB)*; U12 8(DNC)*; U14 8(NIC)* 9(NIC)* 12(NIC)* 13(NIC)* 17(VOB)*; U15 8(DNC)*

### Notes on the sheet
- (near CN8) wired to BNC CH1
- (near CN9) wired to TC1
- ADuM1442ARSZ unavailable,
  replaced with ADUM3482BRSZ,
  some PCB modification required.
- (near CN10) wired to BNC CH2
- (near CN11) wired to TC2
- wired to BNC SW2
- (near CN12) wired to BNC CH3
- wired to switch_1 LED
- wired to switch_2 LED
- Max. sink curent 100 mA
- (near CN15) wired to BNC SW1
- (near CN16) wired to BNC SW2
- Decoupling capacitors for AD8034ARZ ICs. Place one 10nF capacitor
  on each supply pin as close as possible. Place 1uF capacitor close to
  all AD8034ARZ ICs.
- (in symbol Title Block) Title:; LAN Test Monitor; Size:; Number; Revision:; Date:; Sheet:; of; File:; Drawn by:

### Library data of the parts
C16 C17 C53 C56 C61 C67 = Cap 82pF 0603 10%
C50 C51 C55 C59 C60 C64 = Cap 100nF 0603 10%
C52 C58 C66 = Cap 10pF 0603 10%
C54 C62 C68 = Cap 6pF 0603 10%
C57 C65 C70-C74 C76-C78 = Cap 10nF 0603 10%
C75 C79 = Cap 1uF 0603 10%
CN8-CN16 = Phoenix Contact MPT 0.5/2-2.54
D1 D2 D7 D8 D13 D14 D19 D20 = zener diode BZT52C30: Zener Diode; Published: 8-Jun-2000; LatestRevisionDate: 17-Jul-2002; LatestRevisionNote: Re-released for DXP Platform.; PackageReference: DIODE-0.7; Publisher: Altium Limited; PackageDescription: Diode, Thru-Hole; 2 Leads; 0.7 in Pin Spacing
D3 D4 D9 D10 D15 D16 = Diode 1N4148WS-HG3-08: Published: 8-Jun-2000; LatestRevisionDate: 17-Jul-2002; LatestRevisionNote: Re-released for DXP Platform.; PackageVersion: Sep-1996; PackageReference: SMC; Publisher: Altium Limited; PackageDescription: DO-214-AB/SMC; 2 C-Bend Leads; Body 7.9 x 5.9 mm, inc. leads (LxW); Code_JEDEC: DO-214-AB
D5 D6 D11 D12 D17 D18 = Diode BAT721: Schottky diode BAT721; Published: 8-Jun-2000; LatestRevisionDate: 17-Jul-2002; LatestRevisionNote: Re-released for DXP Platform.; PackageVersion: Sep-1996; PackageReference: SMC; Publisher: Altium Limited; PackageDescription: DO-214-AB/SMC; 2 C-Bend Leads; Body 7.9 x 5.9 mm, inc. leads (LxW); Code_JEDEC: DO-214-AB
R27 R28 R34 R40 R41 R47 R53 R54 R60 = Res 100 1% 0603: Manuf_Part_1: MCT 0603-50 1% P5 12K1; Manuf_1: VISHAY; Value: 12K1; Order: 2325243; ECCN_US/EU: n/a; Distrib: FARNELL
R29 R42 R55 = Res 29.4 1% 0603: Manuf_Part_1: MCT 0603-50 1% P5 12K1; Manuf_1: VISHAY; Value: 12K1; Order: 2325243; ECCN_US/EU: n/a; Distrib: FARNELL
R30 R43 R56 = Res 560 1% 0603: Manuf_Part_1: MCT 0603-50 1% P5 12K1; Manuf_1: VISHAY; Value: 12K1; Order: 2325243; ECCN_US/EU: n/a; Distrib: FARNELL
R31 R35-R37 R39 R44 R48-R50 R52 R57 R61-R63 R65-R67 = Res 1k 1% 0603: as R1 on sheet MCU_Sheet1; ECCN_US/EU: n/a; Distrib: FARNELL
R32 R33 R45 R46 R58 R59 = Res 1.8M 1% 0603: Manuf_Part_1: MCT 0603-50 1% P5 12K1; Manuf_1: VISHAY; Value: 12K1; Order: 2325243; ECCN_US/EU: n/a; Distrib: FARNELL
R38 R51 R64 = Res 100k 1% 0603: Manuf_Part_1: MCT 0603-50 1% P5 12K1; Manuf_1: VISHAY; Value: 12K1; Order: 2325243; ECCN_US/EU: n/a; Distrib: FARNELL
R68-R73 = Res 75 1% 0603: as R16 on sheet Ethernet_Sheet2; ECCN_US/EU: n/a; Distrib: FARNELL
R74 R75 = Res 1k5 1% 0603: as R8 on sheet Ethernet_Sheet2; ECCN_US/EU: n/a; Distrib: FARNELL
TR1 TR2 = RQ5H020TNTL: MOSFET N-CH 60V 2A 500mW
U10 U13 U16 = AD8034ARZ: dual op amp; Published: 8-Jun-2000; LatestRevisionDate: 17-Jul-2002; LatestRevisionNote: Re-released for DXP Platform.; DatasheetVersion: REV. B; PackageVersion: 1990; PackageReference: H-08A; Publisher: Altium Limited; PackageDescription: Can; 8 Leads; Pin Circle Dia. 5.08 mm; Lead Dia. 0.53 mm (max); ComponentLink1Description: Manufacturer Link; ComponentLink1URL: http://www.analog.com/
U11 U14 = ADuM1442ARSZ: ADuM1442ARSZ isolator; Manuf_Part_1: MCT 0603-50 1% P5 12K1; Manuf_1: VISHAY; Value: 12K1; Order: 2325243; ECCN_US/EU: n/a; Distrib: FARNELL
U12 U15 = MAX31855K: Thermocouple to digital converter

## Nets that join several sheets
0V_TC1: MCU_Sheet1 (C10.1 U4.4), Input_Stage (7 pins)
0V_TC2: MCU_Sheet1 (C14.1 U6.4), Input_Stage (7 pins)
3.3V: Ethernet_Sheet2 (8 pins), MCU_Sheet1 (41 pins), Input_Stage (C51.2 C60.2 U11.20 U14.20)
3.3V_TC1: MCU_Sheet1 (C10.2 U4.6), Input_Stage (C50.2 C55.1 U11.1 U12.4)
3.3V_TC2: MCU_Sheet1 (C14.2 U6.6), Input_Stage (C59.2 C64.1 U14.1 U15.4)
5V: MCU_Sheet1 (10 pins), Input_Stage (7 pins)
-5V: MCU_Sheet1 (C6.2 U3.4), Input_Stage (7 pins)
GND: Ethernet_Sheet2 (19 pins), MCU_Sheet1 (65 pins), Input_Stage (59 pins)
NetCN6_7: Ethernet_Sheet2 (U8.15), MCU_Sheet1 (CN6.7 U1.25)
NetD5_2: MCU_Sheet1 (U1.41), Input_Stage (D5.2 R31.2 R35.1)
NetD6_2: MCU_Sheet1 (U1.40), Input_Stage (D6.2 R36.2 R39.1)
NetD11_2: MCU_Sheet1 (U1.29), Input_Stage (D11.2 R44.2 R48.1)
NetD12_2: MCU_Sheet1 (U1.28), Input_Stage (D12.2 R49.2 R52.1)
NetD17_2: MCU_Sheet1 (U1.14), Input_Stage (D17.2 R57.2 R61.1)
NetD18_2: MCU_Sheet1 (U1.13), Input_Stage (D18.2 R62.2 R65.1)
NetR7_1: Ethernet_Sheet2 (R7.1 U8.11), MCU_Sheet1 (U1.43)
NetR8_2: Ethernet_Sheet2 (R8.2 U8.12), MCU_Sheet1 (U1.36)
NetR14_1: Ethernet_Sheet2 (R14.1), MCU_Sheet1 (U1.44)
NetR15_1: Ethernet_Sheet2 (R15.1), MCU_Sheet1 (U1.45)
NetR21_1: Ethernet_Sheet2 (R21.1), MCU_Sheet1 (U1.35)
NetR66_1: MCU_Sheet1 (U1.102), Input_Stage (R66.1 R74.1)
NetR67_1: MCU_Sheet1 (U1.103), Input_Stage (R67.1 R75.1)
NetU1_27: Ethernet_Sheet2 (U8.13), MCU_Sheet1 (U1.27)
NetU1_74: Ethernet_Sheet2 (U8.18), MCU_Sheet1 (U1.74)
NetU1_111: MCU_Sheet1 (U1.111), Input_Stage (U11.15 U14.15)
NetU1_112: MCU_Sheet1 (U1.112), Input_Stage (U11.18 U14.18)
NetU1_114: MCU_Sheet1 (U1.114), Input_Stage (U11.16)
NetU1_115: MCU_Sheet1 (U1.115), Input_Stage (U14.16)
NetU1_126: Ethernet_Sheet2 (U8.16), MCU_Sheet1 (U1.126)
NetU1_128: Ethernet_Sheet2 (U8.17), MCU_Sheet1 (U1.128)
REF_2.048V: MCU_Sheet1 (C15.2 U1.32 U5.1), Input_Stage (9 pins)